# EAGLE design mega (EAGLE 9.2.2)
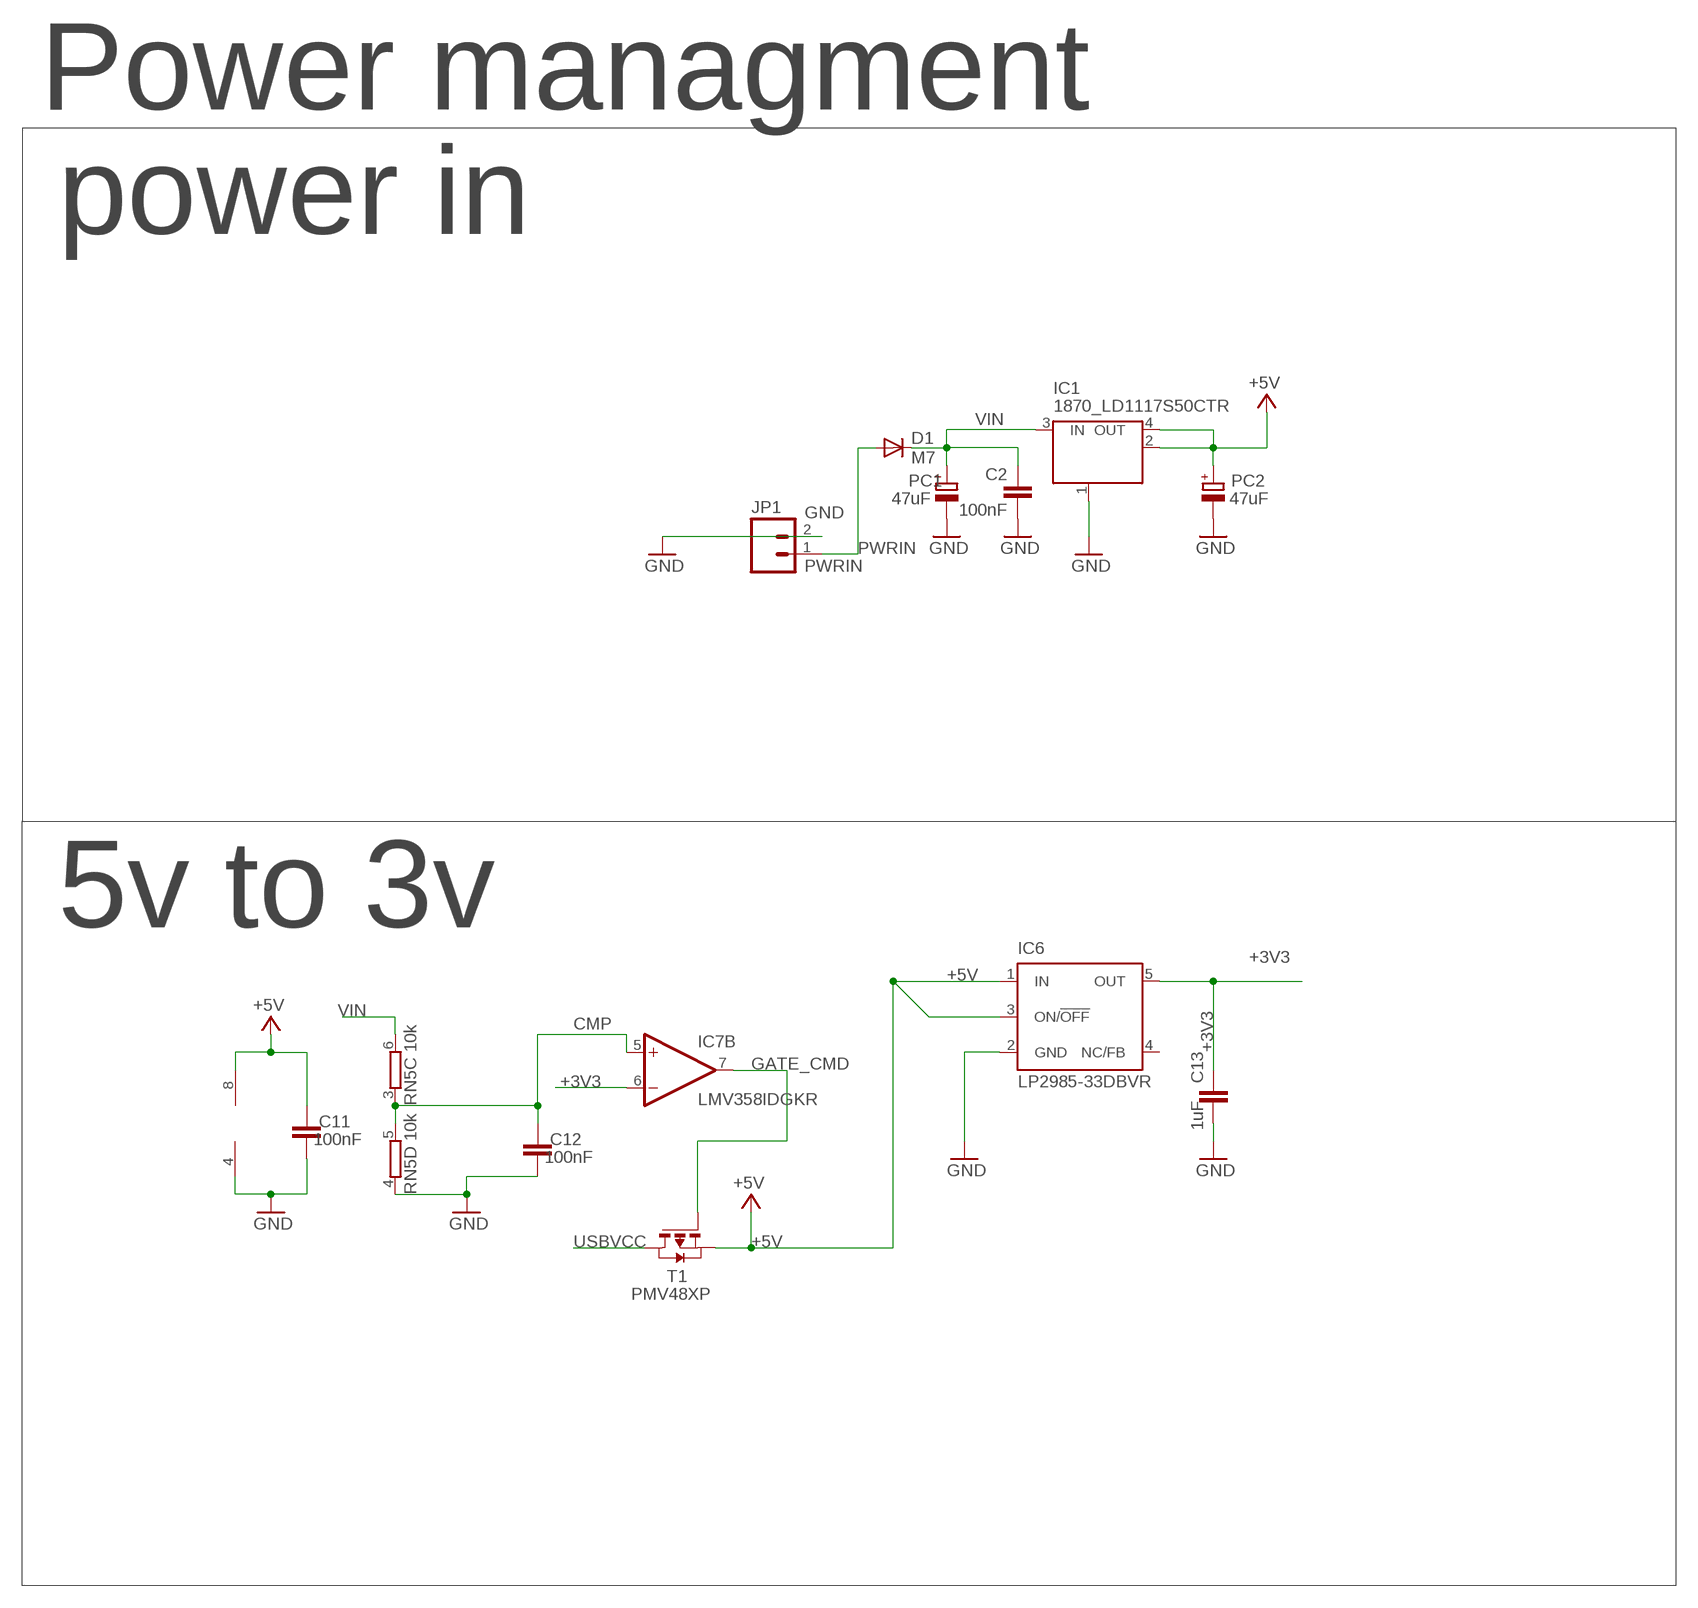
[diagram p0: schematic, sheet 1, part 1 of 2]
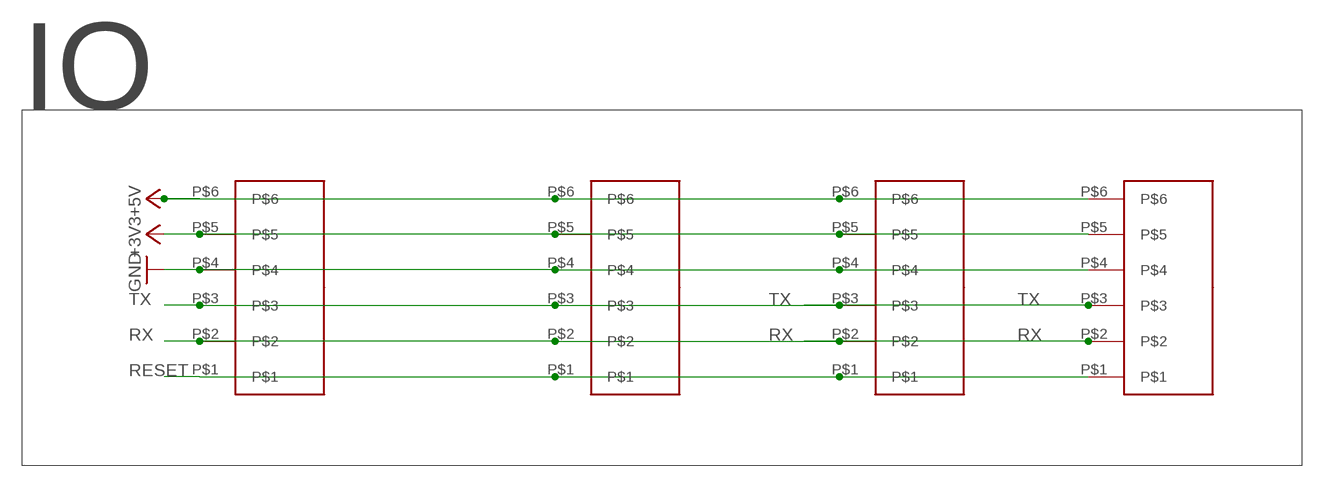
[diagram p1: schematic, sheet 1, part 2 of 2]

## Parts
C2  100nF  0015_100NF_0603  [C0603-ROUND]
C11  100nF  0015_100NF_0603  [C0603-ROUND]
C12  100nF  0015_100NF_0603  [C0603-ROUND]
C13  1uF  0006_1UF_0603/GRM188R61E105KA12D  [C0603-ROUND]
D1  M7  0020_M7  [SMB]
IC1  1870_LD1117S50CTR  [LINEAR_SOT223]
IC6  LP2985-33DBVR  0008_TEXLP2985-33DBVR  [SOT23-DBV]
IC7  LMV358IDGKR  0021_LMV358IDGKR  [MSOP08]
JP1  M02PTH  [1X02]
PC1  47uF  0113_47UF  [PANASONIC_D]
PC2  47uF  0113_47UF  [PANASONIC_D]
RN5  10k  0016_064R_10K_/_CAY16-103J4LF  [CAY16]
T1  PMV48XP  0297_PMV48XP  [SOT-23]
U$1  6PINHERM  [6PINHERMSMD]
U$3  6PINHERM  [6PINHERMSMD]
U$6  6PINHERM  [6PINHERMSMD]
U$7  6PINHERM  [6PINHERMSMD]

## Nets
+3V3 [power]: C13.2 IC6.5(OUT) IC7.6(B:-IN) U$1.P$5 U$3.P$5 U$6.P$5 U$7.P$5
+5V [power usb]: C11.2 IC1.2(OUT) IC1.4(OUT) IC6.1(IN) IC6.3(ON/!OFF) IC7.8(P:V+) PC2.+ T1.2(S) U$1.P$6 U$3.P$6 U$6.P$6 U$7.P$6
CMP: C12.2 IC7.5(B:+IN) RN5.3 RN5.5
GATE_CMD: IC7.7(B:OUT) T1.3(G)
GND [gnd]: C2.2 C11.1 C12.1 C13.1 IC1.1(GND/ADJ) IC6.2(GND) IC7.4(P:V-) JP1.2 PC1.- PC2.- RN5.4 U$1.P$4 U$3.P$4 U$6.P$4 U$7.P$4
PWRIN [power]: D1.A JP1.1
RESET: U$1.P$1 U$3.P$1 U$6.P$1 U$7.P$1
RX: U$1.P$2 U$3.P$2 U$6.P$2 U$7.P$2
TX: U$1.P$3 U$3.P$3 U$6.P$3 U$7.P$3
USBVCC [power usb]: T1.1(D)
VIN [power]: C2.1 D1.C IC1.3(IN) PC1.+ RN5.6
Unconnected: IC6.4(NC/FB) IC7.1(A:OUT) IC7.2(A:-IN) IC7.3(A:+IN) RN5.1 RN5.2 RN5.7 RN5.8

## Notes on the sheet
- Power managment
- power in
- IO
- 5v to 3v

## Library data of the parts
C2 C11 C12 = Condensatori:0015_100NF_0603: 100nF 0603 50V; CASE: 0603; MONTHLY_USAGE: _____; PART_NUMBER: cl10b104kbnc; PRICE: _____; SUPPLIER: _____; TYPE: Condensatori
C13 = Condensatori:0006_1UF_0603/GRM188R61E105KA12D: 1uF 0603; CASE: 0603; MONTHLY_USAGE: _____; PART_NUMBER: 1uF_0603/GRM188R61E105KA12D; PRICE: _____; SUPPLIER: _____; TYPE: Condensatori
D1 = Diodi:0020_M7: 1.0A 40V SURFACE MOUNT GLASS PASSIVATED RECTIFIER M7; CASE: SMA; MONTHLY_USAGE: _____; PART_NUMBER: M7; PRICE: _____; SUPPLIER: _____; TYPE: Diodi
IC1 = IntegratedCircuits:1870_LD1117S50CTR: Low-dropout linear regulator 5V -LM1117IMPX-5.0; CASE: SOT223; MONTHLY_USAGE: _____; PART_NUMBER: LD1117S50CTR; PRICE: _____; SUPPLIER: _____; TYPE: Circuito_Integrato; VALUE: LD1117S50CTR
IC6 = IntegratedCircuits:0008_TEXLP2985-33DBVR: 150-mA LOW-NOISE LOW-DROPOUT REGULATOR WITH SHUTDOWN LP2985-33DBVR; CASE: SOT23-5; MONTHLY_USAGE: _____; PART_NUMBER: TEXLP2985-33DBVR; PRICE: _____; SUPPLIER: _____; TYPE: Circuito_Integrato
IC7 = IntegratedCircuits:0021_LMV358IDGKR: Dual low-voltage (2.7 V to 5.5 V), operational amplifiers with rail-to-rail output swing LMV358IDGKR; CASE: MSOP8; MONTHLY_USAGE: _____; PART_NUMBER: LMV358IDGKR; PRICE: _____; SUPPLIER: _____; TYPE: Circuito_Integrato
JP1 = SparkFun:M02: Header 2 Standard 2-pin 0.1" header. Use with straight break away headers (SKU : PRT-00116), right angle break away headers (PRT-00553), swiss pins (PRT-00743), machine pins (PRT-00117), and female headers (PRT-00115). Molex polarized connector foot print use with SKU : PRT-08233 with associated crimp pins and housings.
PC1 PC2 = Condensatori:0113_47UF: 47uF; MONTHLY_USAGE: _____; PART_NUMBER: 47uF; PRICE: _____; SUPPLIER: _____; TYPE: Condensatori
RN5 = Resistenze:0016_064R_10K_/_CAY16-103J4LF: 10K 064 R; CASE: SMD_3,2x1,6; MONTHLY_USAGE: _____; PART_NUMBER: 064R_10K_/_CAY16-103J4LF; PRICE: _____; SUPPLIER: _____; TYPE: Resistenze
T1 = Transistors:0297_PMV48XP: 20 V, 3.5 A P-channel Trench MOSFET - PMV48XP; CASE: SOT23; MONTHLY_USAGE: _____; PART_NUMBER: PMV48XP; PRICE: _____; SUPPLIER: _____; TYPE: Transistor
U$1 U$3 U$6 U$7 = te_conectivity_6_pin_herm:6PINHERM: https://www.mouser.com/ProductDetail/TE-Connectivity/2213611-3?qs=sGAEpiMZZMsg%252bek5lc7F5uB08Utn55q4E3YUmFQRoIY%3d

## Net classes
0 default: width 0.203 mm, drill 0.406 mm, clearance 0.203 mm
1 power: width 0.61 mm, drill 0.406 mm, clearance 0.203 mm
2 gnd: width 0.305 mm, drill 0.406 mm, clearance 0.203 mm
3 power usb: width 0.508 mm, drill 0.406 mm, clearance 0.203 mm

## Board
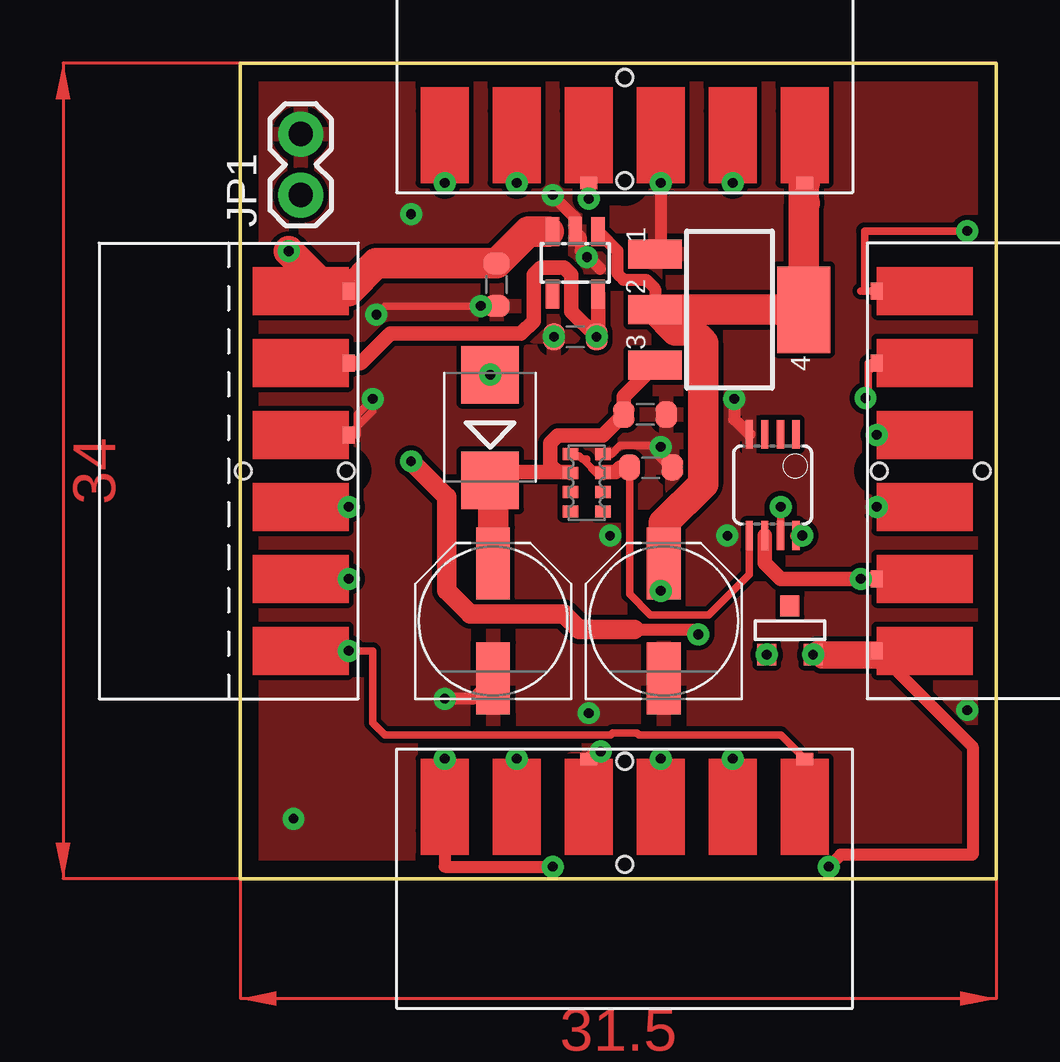
[diagram p2: board, top side]
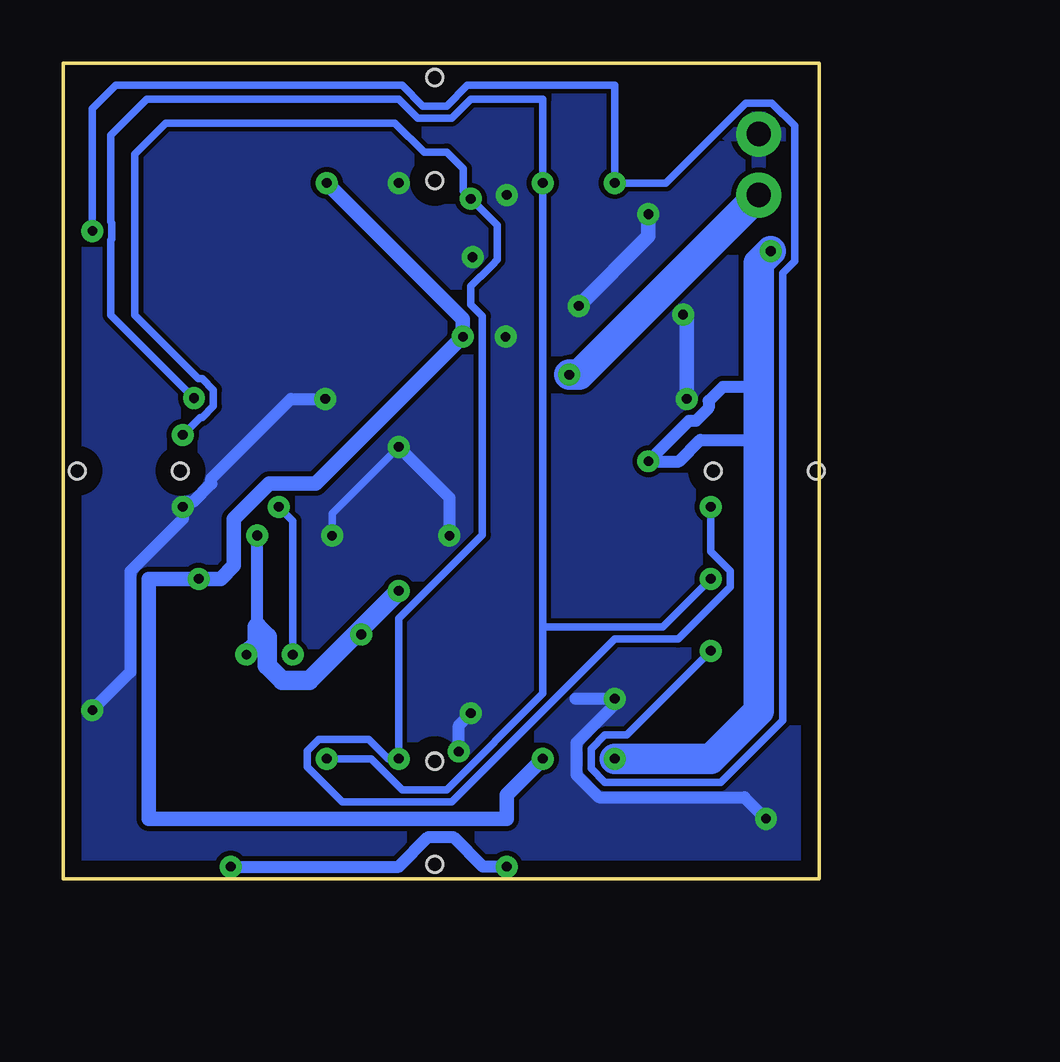
[diagram p3: board, bottom side, seen from below]

Size 31.5 x 34 mm. Coordinates in mm from the lower left corner, seen from the top.
Outline: 0,34 31.5,34 31.5,0 0,0 0,34
Copper layers (1*16): Top 0.035mm / dielectric 1.5mm / Bottom 0.035mm
Design rules "ArduinoMega *": minimum track width 8mil, minimum drill 16mil, track to track 7mil, track to pad 7mil, pad to pad 8mil, via to via 10mil, smd to smd 7mil, copper to edge 27mil, drill to drill 12mil, minimum pad ring 10mil, minimum via ring 10mil, stop-mask expansion 2mil, vias tented up to drill 24mil, thermal gap 10mil

### Footprints (pad centres in the part's own frame; a part is rotated, then mirrored left to right if it is on the bottom)
C0603-ROUND = smd 0.898 x 1.1: 1 -0.889,0; 2 0.889,0
SMB = smd 2.4 x 2.4: A 2.2,0; C -2.2,0
LINEAR_SOT223 = smd 1.219 x 2.235: 1 -2.311,-3.099; 2 0,-3.099; 3 2.311,-3.099 | smd 3.6 x 2.2: 4 0,3.099
SOT23-DBV = smd 0.55 x 1.2: 1 -0.95,-1.3; 2 0,-1.3; 3 0.95,-1.3; 4 0.95,1.3; 5 -0.95,1.3
MSOP08 = smd 0.3 x 1.2: 1 -0.976,-2.113; 2 -0.326,-2.113; 3 0.324,-2.113; 4 0.974,-2.113; 5 0.974,2.112; 6 0.324,2.112; 7 -0.326,2.112; 8 -0.976,2.112
1X02 = drill 1.016 pad 1.88: 1 0,0; 2 2.54,0
PANASONIC_D = smd 3 x 1.4: + 2.4,0; - -2.4,0
CAY16 = smd 0.5 x 0.65: 1 -1.2,-0.675; 2 -0.4,-0.675; 3 0.4,-0.675; 4 1.2,-0.675; 5 1.2,0.675; 6 0.4,0.675; 7 -0.4,0.675; 8 -1.2,0.675
SOT-23 = smd 0.787 x 0.889: 1 0.025,-1.016; 2 -0.94,1.016; 3 0.991,1.016
6PINHERMSMD = smd 0.5 x 0.7: P$1 -5,17; P$2 -5,14; P$3 -5,11; P$4 -5,8; P$5 -5,5; P$6 -5,2 | hole 0.65: -4.9,9.5; -0.6,9.5 | hole 0.7: -4.9,9.5; -0.6,9.5

### Placement (x,y rotation side)
C2  16.86,19.36 0 top
C11  10.68,24.78 90 top
C12  17.1,17.16 180 top
C13  13.95,22.6 0 top
D1  10.41,18.82 90 top
IC1  20.38,23.73 270 top
IC6  13.95,25.68 180 top
IC7  22.18,16.43 180 top
JP1  2.51,28.51 90 top
PC1  10.53,10.76 90 top
PC2  17.64,10.76 90 top
RN5  14.43,16.52 90 top
T1  22.92,10.37 180 top
U$1  6.51,0.01 270 top
U$3  25.51,34.01 90 top
U$6  31.51,7.51 0 top
U$7  -0.49,26.51 180 top

### Tracks (layer width: path | path; a pad name or v marks a point on that pad's centre or on a via)
+3V3  (via drill 0.41)
  Top 0.61: IC6.5 14.9,22.66 C13.2 13.79,23.66 13.79,25.19 13.49,25.49 12.52,25.49 12.22,25.19 12.22,23.27 11.69,22.73 11.01,22.73 6.24,22.73 5.02,21.51 U$7.P$5 | U$6.P$5 v25.85,12.51 22.51,12.51 21.85,13.17 IC7.6
  Bottom 0.61: U$1.P$5 13.01,3.51 13.01,2.51 27.93,2.51 27.93,12.51 v25.85,12.51 24.93,12.51 24.38,13.06 24.38,15.01 22.91,16.48 20.97,16.48 C13.2 14.84,23.34 15.61,24.11 U$3.P$5
  other vias: 11.51,5.01 20.51,29.01 14.84,22.6
+5V  (via drill 0.41)
  Top 0.508: IC1.2 17.28,24.61 16.91,24.98 15.97,24.98 15.7,25.24 15.7,26.18 IC6.1 | IC7.8 v23.42,14.32 | T1.2 24.2,9.01 26.51,9.01 U$6.P$6 30.51,5.51 30.51,1.01 25.01,1.01 v24.51,0.51 | U$1.P$6 8.51,0.51 v13.01,0.51 | PC2.+ 17.51,13.03 v17.51,12.01 | v19.08,10.2 18.87,10.4 16.41,10.4
  Top 0.813: U$6.P$6 24.02,9.51 T1.2 | 16.41,10.4 14.12,10.4 13.48,11.05 10.51,11.05 9.58,11.05 8.6,12.02 8.6,15.93 v7.11,17.41 | IC6.3 12.84,26.98
  Top 1.27: v2.01,26.17 3.67,24.51 U$7.P$6 5.67,25.67 C11.2 11.99,26.98 12.84,26.98 | 23.48,28.14 IC1.4 IC1.2 18.14,22.87 18.74,22.87 19.28,22.33 19.28,16.47 17.64,14.83 PC2.+ | 23.48,28.14 23.51,28.17 | U$3.P$6 23.48,28.98 23.48,28.14
  Bottom 0.508: 23.42,10.51 v23.42,14.32 | v13.01,0.51 14.01,0.51 15.25,1.75 16.28,1.75 17.51,0.51 v24.51,0.51 | v17.51,12.01 19.08,10.45 v19.08,10.2 | 2.51,18.61 2.82,18.3 4.95,18.3 5.84,17.41 v7.11,17.41 5.43,19.1 5.14,19.1 4.6,19.63 4.6,19.93 4.01,20.51 2.51,20.51
  Bottom 0.813: T1.2 23.42,9.8 23.42,10.51 23,10.09 23,8.91 22.37,8.29 21.24,8.29 v17.51,12.01
  Bottom 1.27: U$1.P$6 4.51,5.01 2.51,7.01 2.51,18.61 2.51,20.51 2.51,25.67 v2.01,26.17
  other vias: 8.51,5.01 23.86,9.35
CMP
  Top 0.203: 14.42,17.51 14.47,17.46 14.47,17.35 14.75,17.07 14.96,17.07
  Top 0.254: 14.24,17.51 14.83,16.92
  Top 0.305: RN5.5 13.85,17.62 14.13,17.62 14.24,17.51 14.42,17.51 | RN5.3 14.83,16.92 14.69,17.07 | 14.64,17.12 14.69,17.07 | 14.69,17.07 14.96,17.07 | IC7.5 21.2,12.7 19.66,11.16 19.51,11.01 17.08,11.01 16.22,11.88 C12.2
  Top 0.61: C12.2 15.83,17.16 15.64,16.96 15.15,16.96 RN5.3
GATE_CMD  (via drill 0.41)
  Top 0.305: IC7.7 22.51,14.32 v22.51,15.51
  Bottom 0.305: v22.51,15.51 21.93,14.93 T1.3
  other vias: 21.93,9.35
GND  (via drill 0.41)
  Top 0.305: RN5.4 15.46,17.72 15.8,18.06 17.09,18.06 C12.1 | v10.01,23.89 6.03,23.89 v5.67,23.53 | 4.87,18.51 4.87,19.37 v5.51,20.01 5.51,19.51 U$7.P$4
  Top 0.508: v20.58,20.01 20.58,19.17 IC7.4 | C12.1 17.51,17.64 v17.51,18.01 | v13.01,28.51 13.01,28.5 13.93,27.58 13.93,27 IC6.2 14.17,26.77 14.17,26.19 v14.44,25.93 14.51,25.93 14.99,25.44 | PC1.- 9.69,7.51 v8.51,7.51 | U$1.P$4 14.81,5.31 v15.01,5.31 | U$3.P$4 17.51,26.28 IC1.1
  Top 0.61: C11.1 v10.01,23.89
  Bottom 0.305: v17.51,18.01 20.29,15.23 v20.29,14.31
  Bottom 0.508: v20.58,20.01 22.01,20.01 25.32,16.7 25.32,16.48 26.08,15.72 26.3,15.72 U$6.P$4 26.51,15.01 28.7,12.83 28.7,8.62 v30.28,7.04 | v17.51,18.01 15.4,15.9 v15.4,14.31 | v2.21,2.51 3.11,3.41 9.18,3.41 10.11,4.35 10.11,5.67 8.51,7.27 v8.51,7.51 10.15,7.51 | v15.01,5.31 15.01,6.41 v14.51,6.91
  Bottom 0.61: v10.01,23.89 7.11,26.79 v7.11,27.71 | v5.51,20.01 5.51,23.37 v5.67,23.53
  other vias: 26.51,15.51 13.07,22.6 17.51,29.01
  pour Top: 0.01,34.01 31.51,34.01 31.51,0.01 0.01,0.01
  pour Bottom: 0.01,0.01 31.51,0.01 31.51,34.01 0.01,34.01
PWRIN  (via drill 0.41)
  Bottom 1.27: JP1.1 10,21.02 D1.A
  other vias: 10.41,21.02
RESET  (via drill 0.41)
  Top 0.305: U$6.P$1 26.01,24.51 | 26.01,24.51 25.85,24.51 | v30.28,27.01 26.01,27.01 26.01,24.51 | U$1.P$1 22.51,6.01 16.59,6.01 16.51,6.1 15.52,6.1 15.43,6.01 6.01,6.01 5.51,6.51 5.51,9.51 U$7.P$1
  Bottom 0.305: U$7.P$1 8.02,6 8.92,6 9.51,5.42 9.51,4.6 8.92,4.02 4.1,4.02 1.52,6.6 1.52,25.26 1.02,25.76 1.02,31.39 1.98,32.35 3.05,32.35 6.39,29.01 U$3.P$1 8.51,33.09 14.66,33.09 15.52,32.22 16.51,32.22 17.37,33.09 29.31,33.09 30.28,32.12 v30.28,27.01
  other vias: 8.51,29.01 4.51,9.51
RX  (via drill 0.41)
  Top 0.305: v26.05,20.04 26.16,20.16 26.16,21.16 | 26.16,21.16 26.16,21.51 U$6.P$2 26.16,21.16
  Bottom 0.305: v26.05,20.04 29.51,23.51 29.51,26.63 29.47,26.68 29.47,27.35 29.51,27.39 29.51,31.01 28.01,32.51 17.51,32.51 16.72,31.72 15.31,31.72 14.52,32.51 11.51,32.51 U$3.P$2 11.51,10.51 | U$1.P$2 18.66,5.01 17.38,3.72 15.52,3.72 11.51,7.73 11.51,10.51 | U$7.P$2 6.51,10.51 9.51,10.51 9.91,10.51 11.51,10.51
  other vias: 11.51,29.01 20.51,5.01 4.51,12.51
TX  (via drill 0.41)
  Top 0.305: 14.51,28.66 v14.51,28.35 U$3.P$3
  Bottom 0.305: U$6.P$3 25.79,19.23 25.71,19.23 25.23,19.71 25.23,20.38 25.71,20.86 25.86,20.86 28.51,23.51 28.51,30.21 27.21,31.51 17.67,31.51 16.46,30.3 15.52,30.3 14.83,29.6 14.83,28.66 v14.51,28.35 13.41,27.25 13.41,25.81 13.63,25.6 13.63,25.59 14.1,25.11 14.11,25.11 14.51,24.71 14.51,23.95 14.03,23.46 14.03,14.35 17.51,10.86 U$1.P$3 17.95,5.01 18.76,5.82 20.85,5.82 21.33,5.35 21.33,4.67 19.87,3.22 15.31,3.22 8.52,10 5.87,10 3.7,12.18 3.7,12.85 4.51,13.66 U$7.P$3
  other vias: 26.51,18.51 17.51,5.01 4.51,15.51
VIN
  Top 0.61: IC1.3 15.97,20.11 C2.1 15.09,18.48 13.22,18.48 12.92,18.18 12.92,17.26 13.22,16.96 | 13.22,16.96 13.71,16.96 RN5.6 | 13.22,16.96 10.75,16.96 D1.C
  Top 1.27: D1.C 10.53,16.5 PC1.+
(copper drawn outside any net)
  shapes: Top area x2

### Text on the board
ReferenceLC: L | TX | RX
test-probe: ISP2_6 | ISP2_4 | ISP2_2 | ISP2_1 | ISP2_3 | ISP2_5 | USB1_D-